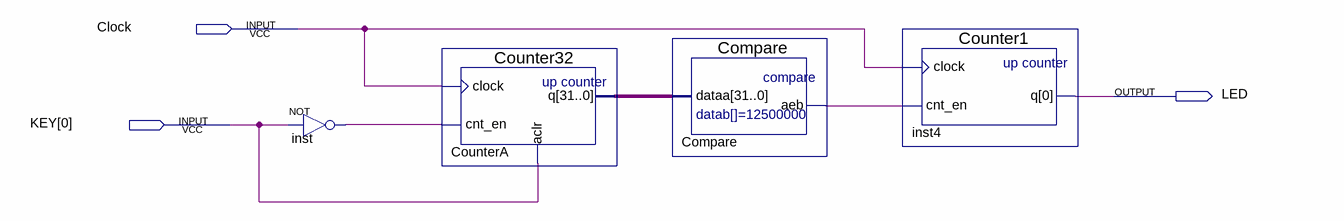
[diagram p0: schematic sheet]
// Quartus schematic debounce_t (2022_05_22 18_19_10 UTC).bdf as structural Verilog: 4 symbols, 3 pins
module \debounce_t_(2022_05_22_18_19_10_UTC)  (
  input  Clock,
  input  [0:0] KEY,
  output LED
);

  wire Compare_aeb, inst_out;
  wire [31:0] CounterA_q;

  not inst (inst_out, KEY[0]);
  Counter32 CounterA (.clock(Clock), .cnt_en(inst_out), .aclr(KEY[0]), .q(CounterA_q));
  Compare Compare (.dataa(CounterA_q), .aeb(Compare_aeb));
  Counter1 inst4 (.clock(Clock), .cnt_en(Compare_aeb), .q(LED));
endmodule
